# Altium schematic sheet Logica_ADC.SchDoc: CSN Detector V3_1
size A4; CheckedBy: RCP; Author: RCP; DrawnBy: RCP; Address1: LIM-HGGM; Address3: RCP; DocumentNumber: 1; Revision: 1; SheetNumber: 2; SheetTotal: 2; PageSetup: Record=PageOptions|CenterHorizontal=True|CenterVertical=True|PrintScale=1.00|XCorrection=1.00|YCorrection=1.00|PrintKind=0|BorderSize=5000000|LeftOffset=0|BottomOffset=0|Orientation=2|PaperLength=1000|PaperWidth=1000|Scale=100|PaperSource=7|PrintQuality=-4|MediaType=1|DitherType=10|PaperKind=A4|PrintScaleMode=1
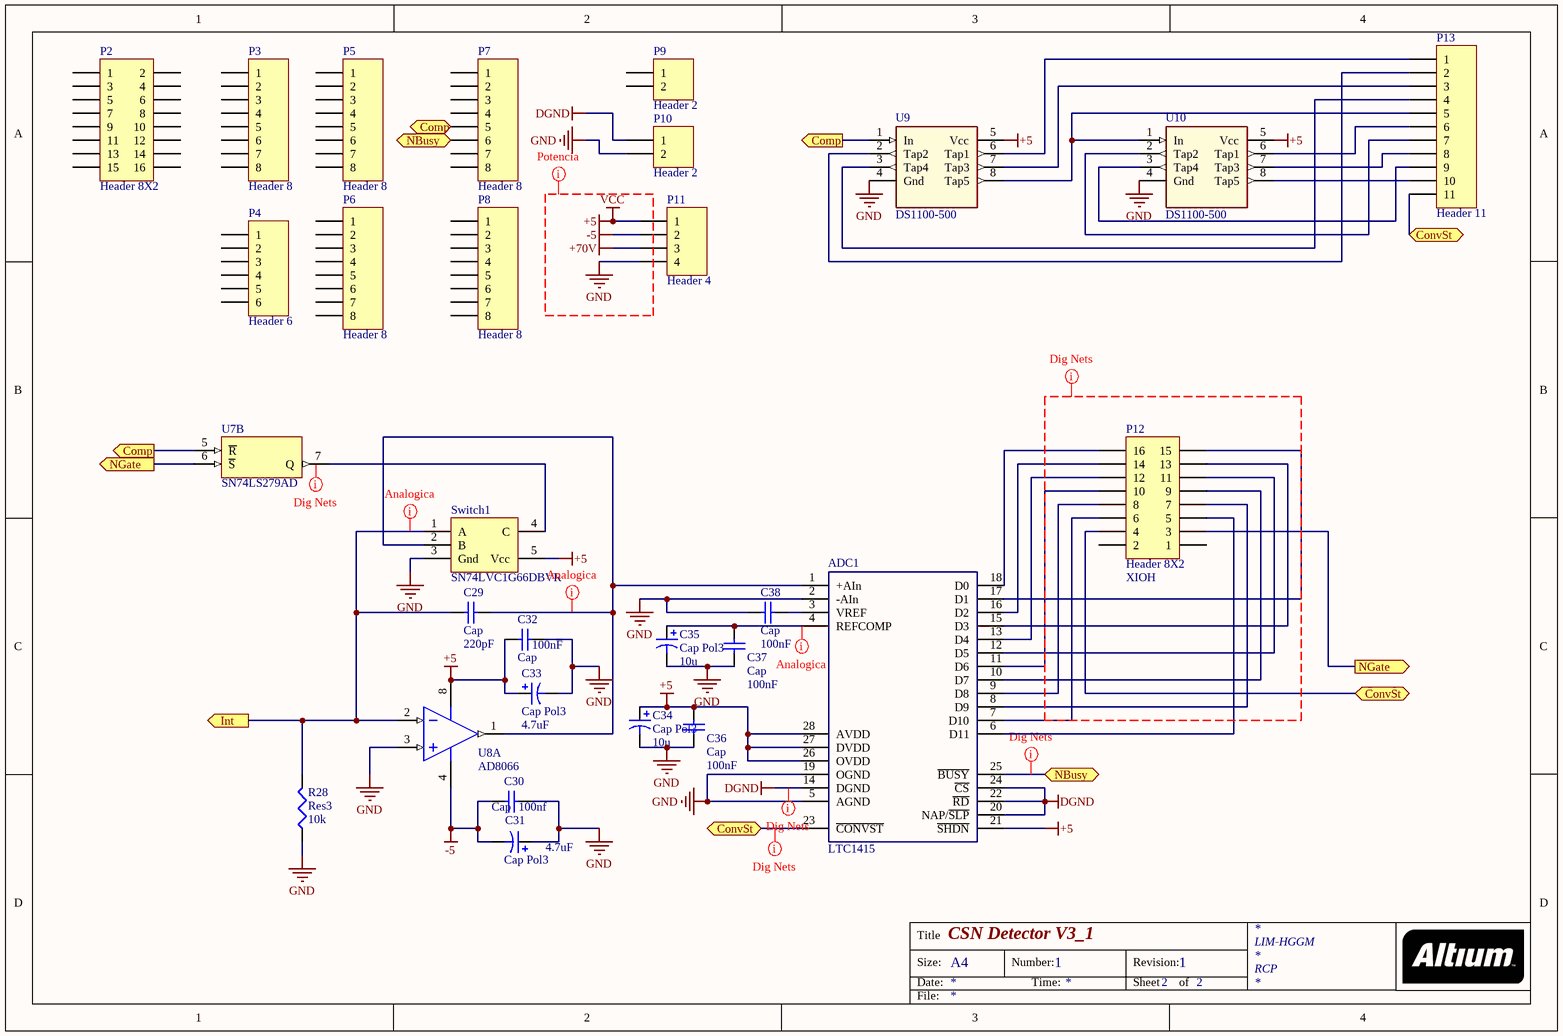
[diagram p0: Logica_ADC.SchDoc]

## Parts
ADC1  LTC1415  [SO28_N]
C29  Cap  value 220pF  [6-0805_N]
C30  Cap  value 100nf  [6-0805_N]
C31  Cap Pol3  value 4.7uF  [6-0805_N]
C32  Cap  value 100nF  [6-0805_N]
C33  Cap Pol3  value 4.7uF  [6-0805_N]
C34  Cap Pol3  value 10u  [6-0805_N]
C35  Cap Pol3  value 10u  [6-0805_N]
C36  Cap  value 100nF  [6-0805_N]
C37  Cap  value 100nF  [6-0805_N]
C38  Cap  value 100nF  [6-0805_N]
P2  Header 8X2  [HDR2X8]
P3  Header 8  [HDR1X8]
P4  Header 6  [HDR1X6]
P5  Header 8  [HDR1X8]
P6  Header 8  [HDR1X8]
P7  Header 8  [HDR1X8]
P8  Header 8  [HDR1X8]
P9  Header 2  [HDR1X2]
P10  Header 2  [HDR1X2]
P11  Header 4  [HDR1X4]
P12  Header 8X2  Con_Arduino: XIOH  [HDR2X8]
P13  Header 11  [HDR1X11]
R28  Res3  value 10k  [6-0805_N]
Switch1  SN74LVC1G66DBVR  [SOT23-5_N]
U7  SN74LS279AD  [D016_N]  (part B of 4)
U8  AD8066  [S8_N]  (part A of 2)
U9  DS1100-500  [SO-8_L]
U10  DS1100-500  [SO-8_L]

## Ports
Comp (out), ConvSt, Int (out), NBusy, NGate (out)

## Nets
+5: ADC1.21(~{SHDN}) ADC1.26(OVDD) ADC1.27(DVDD) ADC1.28(AVDD) C32.2 C33.1 C34.1 C36.2 P11.1 Switch1.5(Vcc) U7.16(VCC) U8.8(V+) U9.5(Vcc) U10.5(Vcc)  [also labelled VCC]
+70V: P11.3
-5: C30.1 C31.2 P11.2 U8.4(V-)
DGND: ADC1.14(DGND) ADC1.20(NAP/~{SLP}) ADC1.22(~{RD}) ADC1.24(~{CS}) P10.1
GND: ADC1.2(-AIn) ADC1.5(AGND) ADC1.19(OGND) C30.2 C31.1 C32.1 C33.2 C34.2 C35.2 C36.1 C37.1 C38.2 P10.2 P11.4 R28.1 Switch1.3(Gnd) U7.8(GND) U8.3(IN+) U9.4(Gnd) U10.4(Gnd)
Comp: P7.5 U7.5(~{R}) U9.1(In) ; port Comp
ConvSt: ADC1.23(~{CONVST}) P12.4 P13.11 ; port ConvSt
Int: C29.1 R28.2 Switch1.1(A) U8.2(IN-) ; port Int
NBusy: ADC1.25(~{BUSY}) P7.6 ; port NBusy
NGate: P12.3 U7.6(~{S}) ; port NGate
NetADC1_1: ADC1.1(+AIn) C29.2 Switch1.2(B) U8.1(OUT)
NetADC1_3: ADC1.3(VREF) C38.1
NetADC1_4: ADC1.4(REFCOMP) C35.1 C37.2
NetADC1_6: ADC1.6(D11) P12.5
NetADC1_7: ADC1.7(D10) P12.6
NetADC1_8: ADC1.8(D9) P12.7
NetADC1_9: ADC1.9(D8) P12.8
NetADC1_10: ADC1.10(D7) P12.9
NetADC1_11: ADC1.11(D6) P12.10
NetADC1_12: ADC1.12(D5) P12.11
NetADC1_13: ADC1.13(D4) P12.12
NetADC1_15: ADC1.15(D3) P12.13
NetADC1_16: ADC1.16(D2) P12.14
NetADC1_17: ADC1.17(D1) P12.15
NetADC1_18: ADC1.18(D0) P12.16
NetP13_1: P13.1 U9.6(Tap1)
NetP13_2: P13.2 U9.2(Tap2)
NetP13_3: P13.3 U9.7(Tap3)
NetP13_4: P13.4 U9.3(Tap4)
NetP13_5: P13.5 U9.8(Tap5) U10.1(In)
NetP13_6: P13.6 U10.6(Tap1)
NetP13_7: P13.7 U10.2(Tap2)
NetP13_8: P13.8 U10.7(Tap3)
NetP13_9: P13.9 U10.3(Tap4)
NetP13_10: P13.10 U10.8(Tap5)
NetSwitch1_4: Switch1.4(C) U7.7(Q)

Not connected (* = marked no-connect by the designer): P2 1 2 3 4 5 6 7 8 9 10 11 12 13 14 15 16; P3 1 2 3 4 5 6 7 8; P4 1 2 3 4 5 6; P5 1 2 3 4 5 6 7 8; P6 1 2 3 4 5 6 7 8; P7 1 2 3 4 7 8; P8 1 2 3 4 5 6 7 8; P9 1 2; P12 1 2

## Layout directives
net class digital: (no net found under the mark), ConvSt, DGND, NBusy
net class potencia: +5, +70V, -5, GND, VCC
net class analog: Int, NetADC1_1, NetADC1_4

## Notes on the sheet
- Title
- Size:
- Date:
- A4
- Number:
- Time:
- Revision:
- Sheet
- of
- File:

## Library data of the parts
C29 C30 C32 C36-C38 = Cap: Capacitor; Published: 8-Jun-2000; LatestRevisionDate: 17-Jul-2002; LatestRevisionNote: Re-released for DXP Platform.; PackageReference: RAD-0.3; Publisher: Altium Limited; PackageDescription: Radial Cap, Thru-Hole; 2 Leads; 0.3 in Pin Spacing
C31 C33-C35 = Cap Pol3: Polarized Capacitor (Surface Mount); Published: 8-Jun-2000; LatestRevisionDate: 29-May-2009; LatestRevisionNote: IPC-7351 Footprint Added.; PackageReference: C0805; Publisher: Altium Limited; PackageDescription: Chip Capacitor
P2 P12 = Header 8X2: Header, 8-Pin, Dual row; LatestRevisionDate: 17-Jul-2002; LatestRevisionNote: Re-released for DXP Platform.; Publisher: Altium Limited
P3 P5-P8 = Header 8: Header, 8-Pin; LatestRevisionDate: 17-Jul-2002; LatestRevisionNote: Re-released for DXP Platform.; Publisher: Altium Limited
P4 = Header 6: Header, 6-Pin; LatestRevisionDate: 17-Jul-2002; LatestRevisionNote: Re-released for DXP Platform.; Publisher: Altium Limited
P9 P10 = Header 2: Header, 2-Pin; LatestRevisionDate: 17-Jul-2002; LatestRevisionNote: Re-released for DXP Platform.; Publisher: Altium Limited
P11 = Header 4: Header, 4-Pin; LatestRevisionDate: 17-Jul-2002; LatestRevisionNote: Re-released for DXP Platform.; Publisher: Altium Limited
P13 = Header 11: Header, 11-Pin; LatestRevisionDate: 17-Jul-2002; LatestRevisionNote: Re-released for DXP Platform.; Publisher: Altium Limited
R28 = Res3: Resistor; Published: 8-Jun-2000; LatestRevisionDate: 29-May-2009; LatestRevisionNote: IPC-7351 Footprint Added.; PackageReference: J1-0603; Publisher: Altium Limited; PackageDescription: Chip Resistor
U7 = SN74LS279AD: Quadruple S-R Latches; Published: 8-Jun-2000; LatestRevisionDate: 13-Apr-2006; LatestRevisionNote: IPC-7351 Footprint Added.; DatasheetVersion: Mar-1988; PackageVersion: Jan-1998; PackageReference: D016; Publisher: Altium Limited; PackageDescription: 16-Pin Small Outline Integrated Circuit 1.27 mm Pitch; Code_IPC: SOIC127P600-16; ComponentLink1Description: Manufacturer Link; ComponentLink1URL: http://www.ti.com/; ComponentLink2Description: Datasheet; ComponentLink2URL: http://www-s.ti.com/sc/ds/sn54279.pdf
U8 = LT1253CS8: Low Cost Dual Video Amplifier; Note: 1003; Published: 8-Jun-2000; LatestRevisionDate: 13-Apr-2006; LatestRevisionNote: IPC-7351 Footprint Added.; DatasheetVersion: 1996; PackageReference: S8; Publisher: Altium Limited; PackageDescription: 8-Pin Small Outline Integrated Circuit 1.27 mm Pitch; Code_JEDEC: MS-012-AA; Code_IPC: SOIC127P600-8; ComponentLink1Description: Manufacturer Link; ComponentLink1URL: http://www.linear.com/; ComponentLink2Description: Datasheet; ComponentLink2URL: http://www.linear.com/pc/downloadDocument.do?navId=H0,C1,C1154,C1009,C1022,P1423,D1129